# EAGLE design amplifier4c (EAGLE 6.5.0)
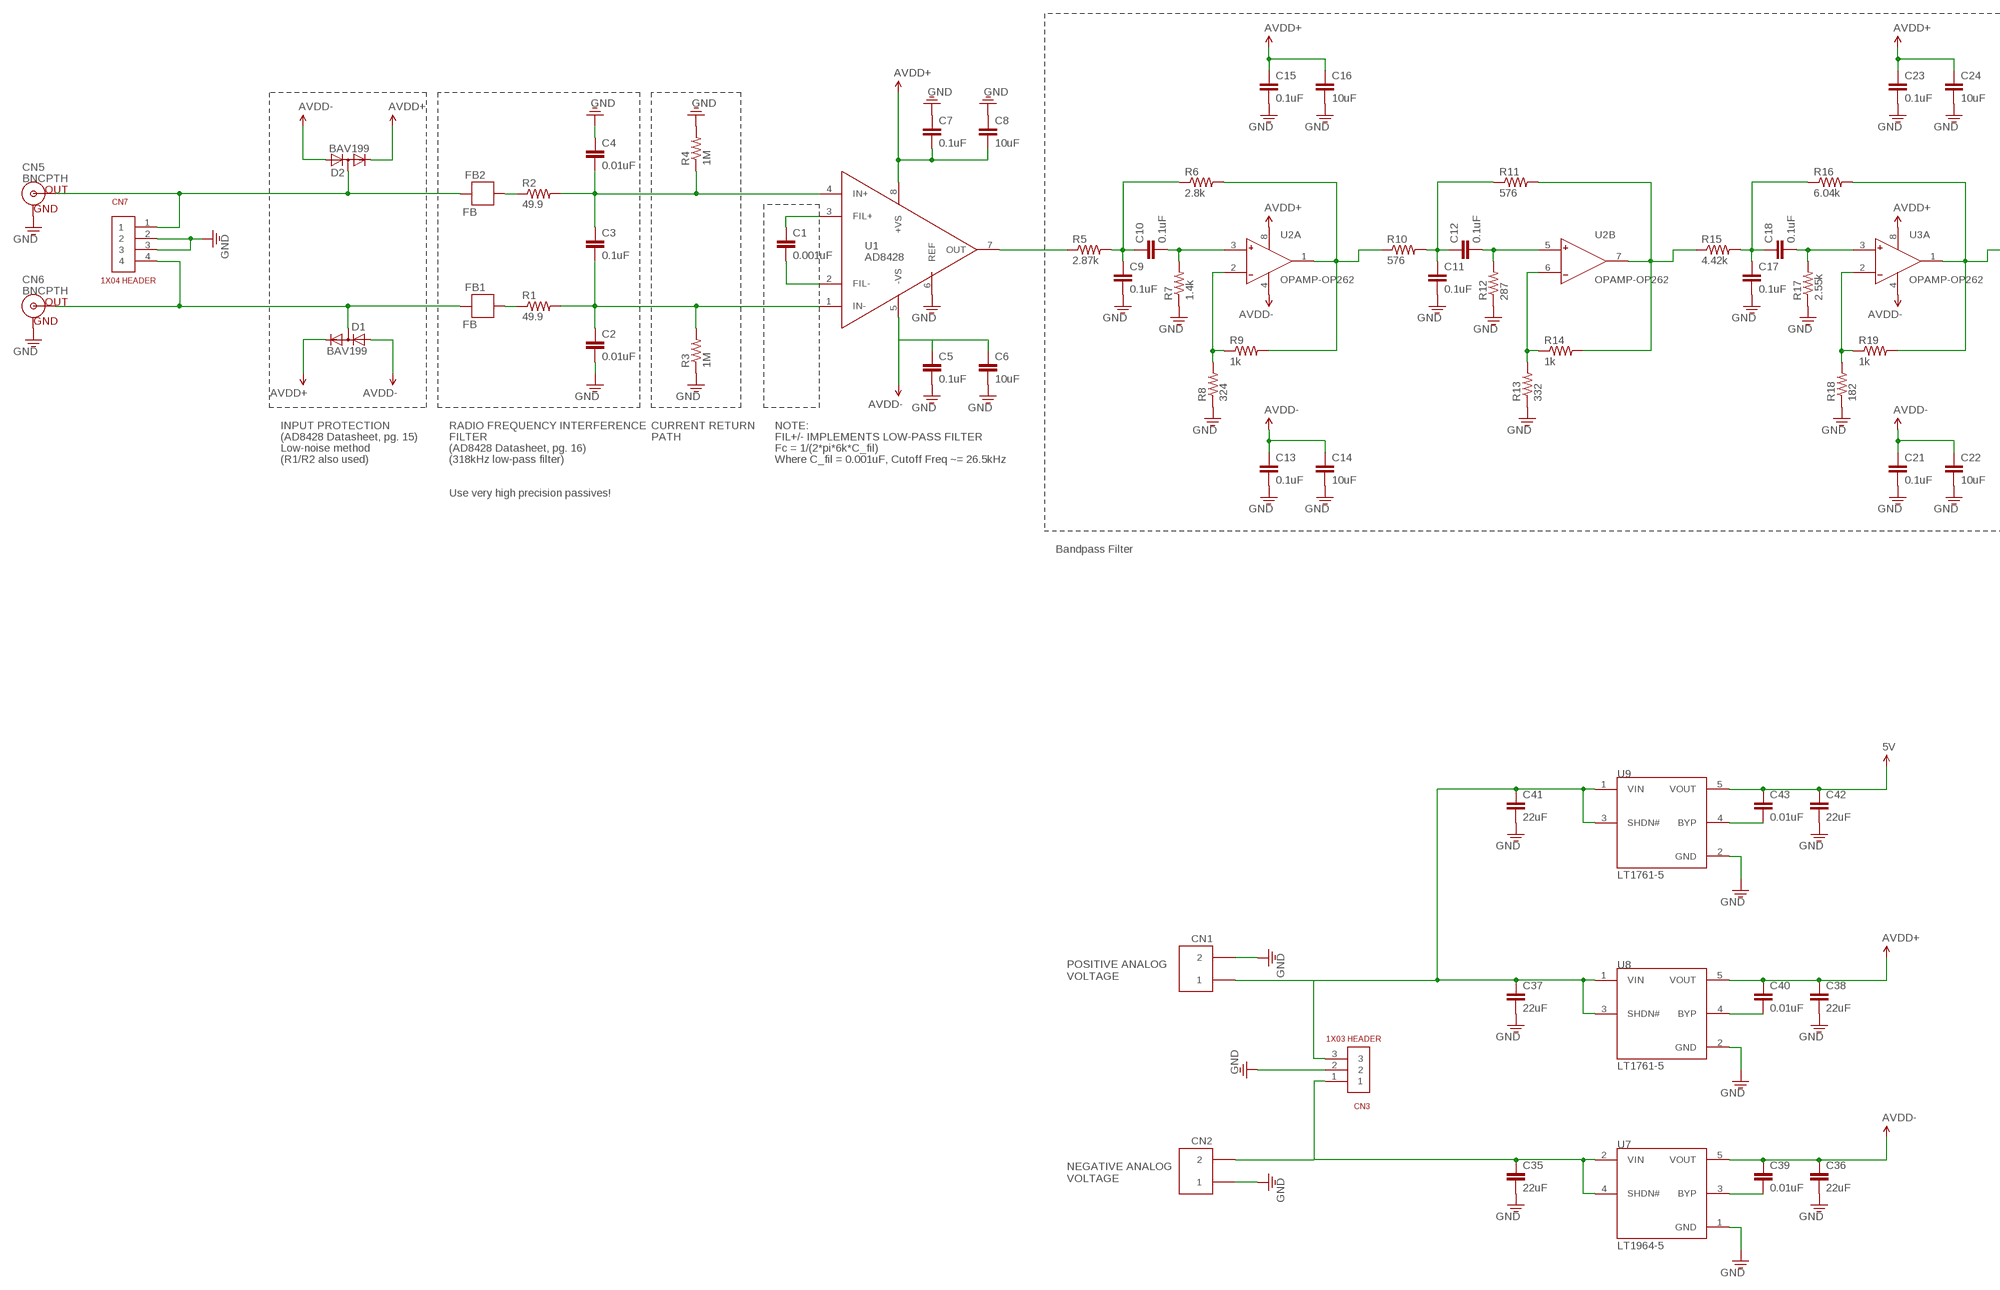
[diagram p0: schematic, sheet 1, part 1 of 2]
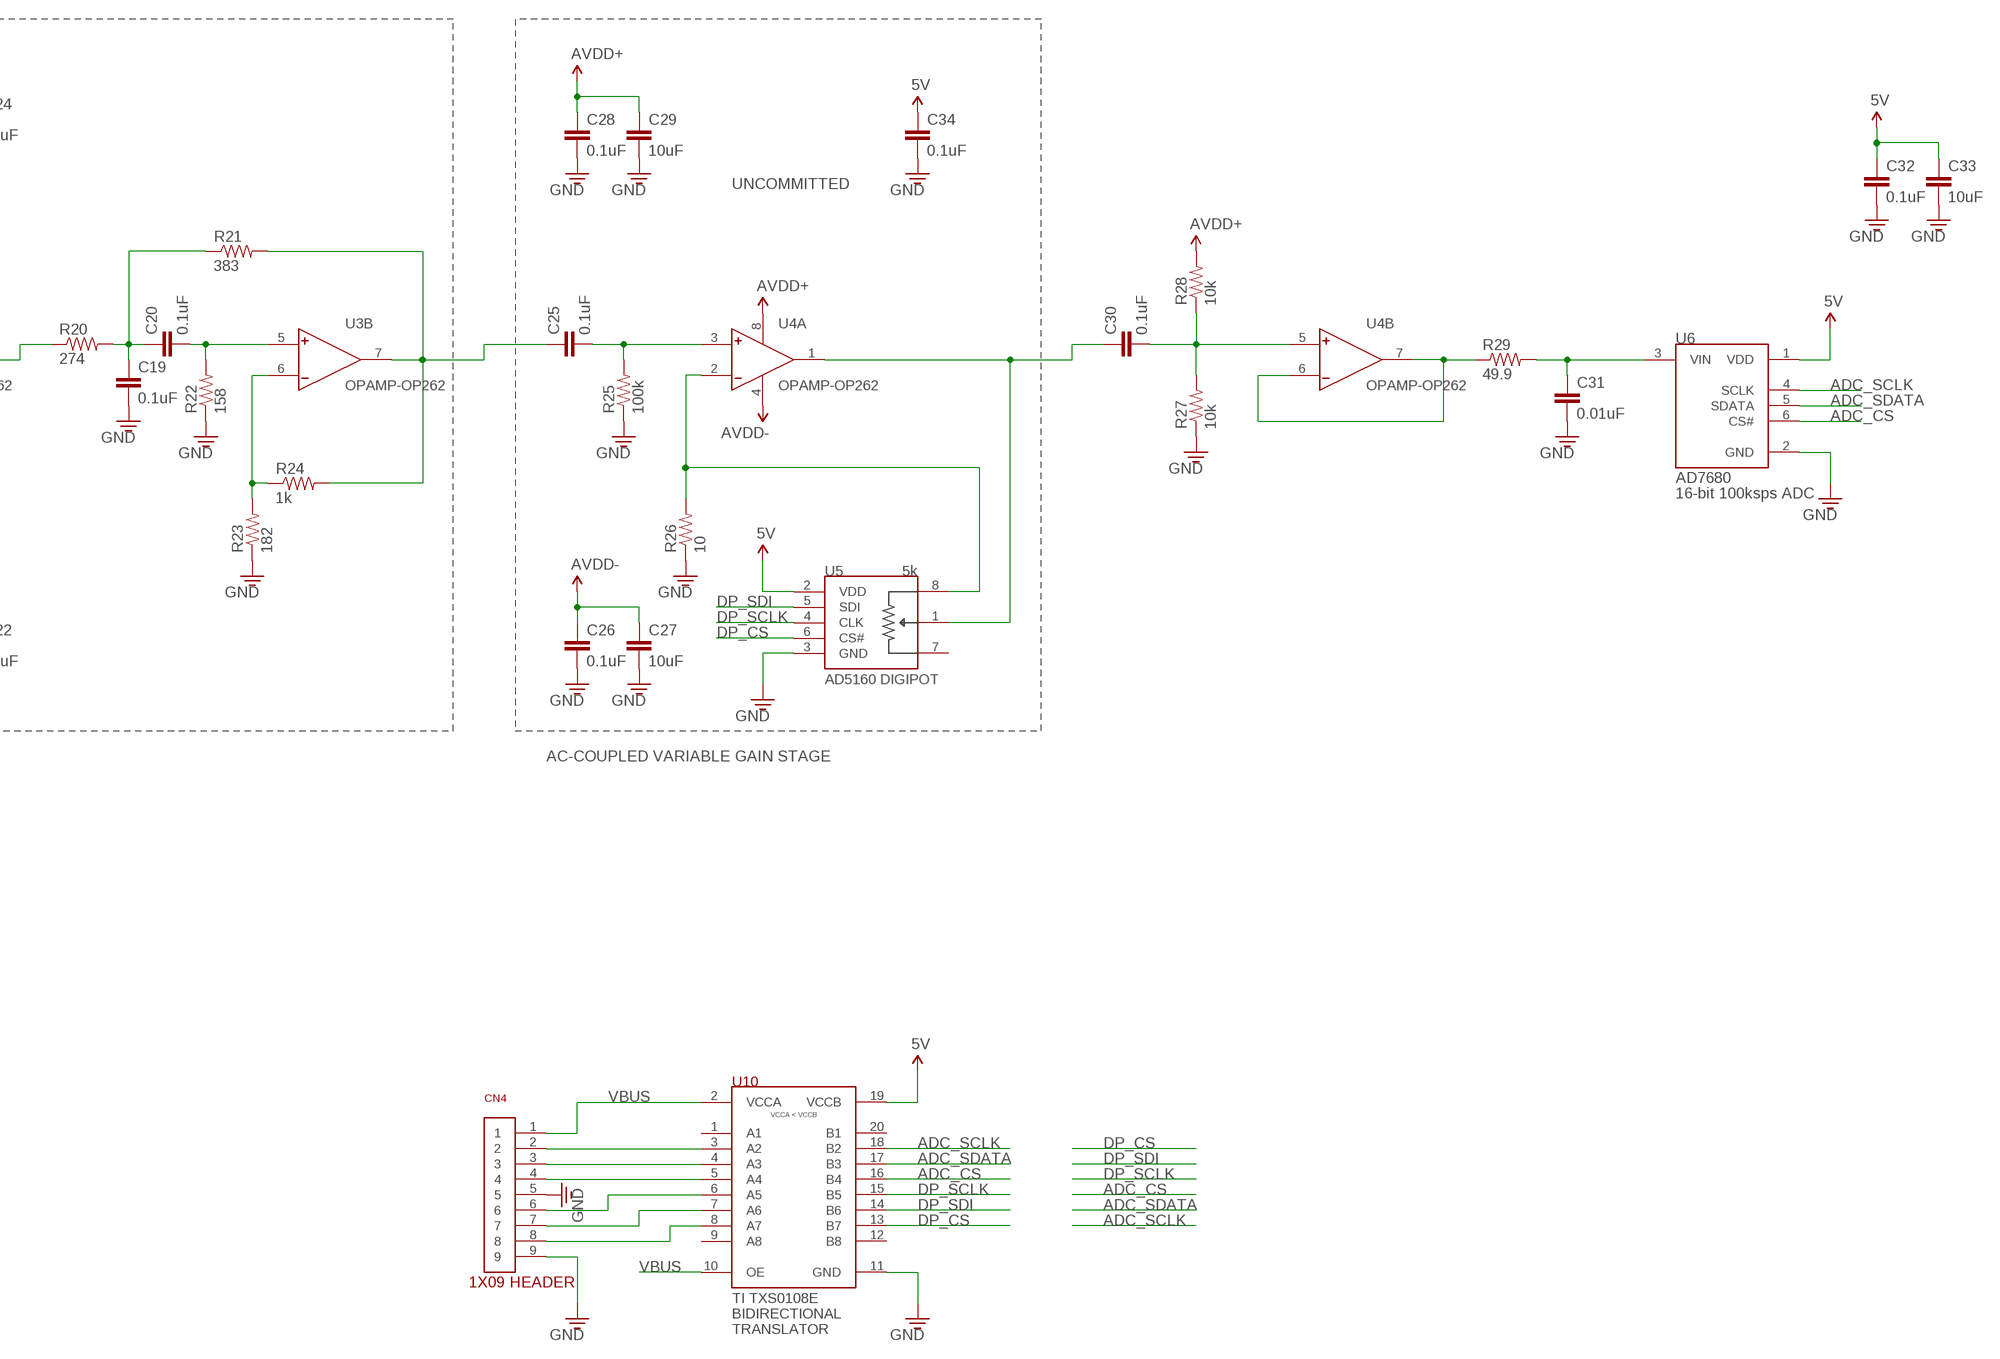
[diagram p1: schematic, sheet 1, part 2 of 2]

## Parts
C1  0.001uF  CAP0603  [0603]
C2  0.01uF  CAP0603  [0603]
C3  0.1uF  CAP0603  [0603]
C4  0.01uF  CAP0603  [0603]
C5  0.1uF  CAP0603  [0603]
C6  10uF  CAP0805  [0805]
C7  0.1uF  CAP0603  [0603]
C8  10uF  CAP0805  [0805]
C9  0.1uF  CAP0603  [0603]
C10  0.1uF  CAP0603  [0603]
C11  0.1uF  CAP0603  [0603]
C12  0.1uF  CAP0603  [0603]
C13  0.1uF  CAP0603  [0603]
C14  10uF  CAP0805  [0805]
C15  0.1uF  CAP0603  [0603]
C16  10uF  CAP0805  [0805]
C17  0.1uF  CAP0603  [0603]
C18  0.1uF  CAP0603  [0603]
C19  0.1uF  CAP0603  [0603]
C20  0.1uF  CAP0603  [0603]
C21  0.1uF  CAP0603  [0603]
C22  10uF  CAP0805  [0805]
C23  0.1uF  CAP0603  [0603]
C24  10uF  CAP0805  [0805]
C25  0.1uF  CAP0603  [0603]
C26  0.1uF  CAP0603  [0603]
C27  10uF  CAP0805  [0805]
C28  0.1uF  CAP0603  [0603]
C29  10uF  CAP0805  [0805]
C30  0.1uF  CAP0603  [0603]
C31  0.01uF  CAP0603  [0603]
C32  0.1uF  CAP0603  [0603]
C33  10uF  CAP0805  [0805]
C34  0.1uF  CAP0603  [0603]
C35  22uF  CAP1206  [1206]
C36  22uF  CAP1206  [1206]
C37  22uF  CAP1206  [1206]
C38  22uF  CAP1206  [1206]
C39  0.01uF  CAP0603  [0603]
C40  0.01uF  CAP0603  [0603]
C41  22uF  CAP1206  [1206]
C42  22uF  CAP1206  [1206]
C43  0.01uF  CAP0603  [0603]
CN1  SCREWTERMINAL-2PIN  [SCREWTERMINAL-2PIN]
CN2  SCREWTERMINAL-2PIN  [SCREWTERMINAL-2PIN]
CN3  1X03  [1X03]
CN4  1X09  [1X09]
CN5  BNCPTH  [BNC]
CN6  BNCPTH  [BNC]
CN7  1X04  [1X04]
D1  BAV199  [SOT23]
D2  BAV199  [SOT23]
FB1  FB  [0603]
FB2  FB  [0603]
R1  49.9  RESISTOR0603  [0603]
R2  49.9  RESISTOR0603  [0603]
R3  1M  RESISTOR0603  [0603]
R4  1M  RESISTOR0603  [0603]
R5  2.87k  RESISTOR0603  [0603]
R6  2.8k  RESISTOR0603  [0603]
R7  1.4k  RESISTOR0603  [0603]
R8  324  RESISTOR0603  [0603]
R9  1k  RESISTOR0603  [0603]
R10  576  RESISTOR0603  [0603]
R11  576  RESISTOR0603  [0603]
R12  287  RESISTOR0603  [0603]
R13  332  RESISTOR0603  [0603]
R14  1k  RESISTOR0603  [0603]
R15  4.42k  RESISTOR0603  [0603]
R16  6.04k  RESISTOR0603  [0603]
R17  2.55k  RESISTOR0603  [0603]
R18  182  RESISTOR0603  [0603]
R19  1k  RESISTOR0603  [0603]
R20  274  RESISTOR0603  [0603]
R21  383  RESISTOR0603  [0603]
R22  158  RESISTOR0603  [0603]
R23  182  RESISTOR0603  [0603]
R24  1k  RESISTOR0603  [0603]
R25  100k  RESISTOR0603  [0603]
R26  10  RESISTOR0603  [0603]
R27  10k  RESISTOR0603  [0603]
R28  10k  RESISTOR0603  [0603]
R29  49.9  RESISTOR0603  [0603]
U1  OPAMP-AD8428  [SOIC-8]
U2  OPAMP-OP262  [SOIC-8]
U3  OPAMP-OP262  [SOIC-8]
U4  OPAMP-OP262  [SOIC-8]
U5  5k  AD5160  [SOT-23-8]
U6  ADC-AD7680  [SOT-23-6L]
U7  LT1964-5  REG-LT1964-X  [SOT-23-5L]
U8  LT1761-5  REG-LT1761-X  [SOT-23-5L]
U9  LT1761-5  REG-LT1761-X  [SOT-23-5L]
U10  TRANSLATOR-TXS0108E  [TSSOP-20]

## Nets
5V: C32.1 C33.1 C34.1 C42.1 C43.1 U5.2(VDD) U6.1(VDD) U9.5(VOUT) U10.19(VCCB)
ADC_CS: U6.6(CS#) U10.16(B4)
ADC_SCLK: U6.4(SCLK) U10.18(B2)
ADC_SDATA: U6.5(SDATA) U10.17(B3)
AVDD+: C7.2 C8.2 C15.1 C16.1 C23.1 C24.1 C28.1 C29.1 C38.1 C40.1 D1.2(C) D2.2(C) R28.2 U1.8(+VS) U2.8(A:V+) U3.8(A:V+) U4.8(A:V+) U8.5(VOUT)
AVDD-: C5.1 C6.1 C13.1 C14.1 C21.1 C22.1 C26.1 C27.1 C36.1 C39.1 D1.1(A) D2.1(A) U1.5(-VS) U2.4(A:V-) U3.4(A:V-) U4.4(A:V-) U7.5(VOUT)
DP_CS: U5.6(CS#) U10.13(B7)
DP_SCLK: U5.4(CLK) U10.15(B5)
DP_SDI: U5.5(SDI) U10.14(B6)
GND: C2.2 C4.1 C5.2 C6.2 C7.1 C8.1 C9.2 C11.2 C13.2 C14.2 C15.2 C16.2 C17.2 C19.2 C21.2 C22.2 C23.2 C24.2 C26.2 C27.2 C28.2 C29.2 C31.2 C32.2 C33.2 C34.2 C35.2 C36.2 C37.2 C38.2 C41.2 C42.2 CN1.2 CN2.1 CN3.2 CN4.5 CN4.9 CN5.GND CN6.GND CN7.2 CN7.3 R3.1 R4.2 R7.1 R8.1 R12.1 R13.1 R17.1 R18.1 R22.1 R23.1 R25.1 R26.1 R27.1 U1.6(REF) U5.3(GND) U6.2(GND) U7.1(GND) U8.2(GND) U9.2(GND) U10.11(GND)
N$1: C1.1 U1.3(FIL+)
N$2: C1.2 U1.2(FIL-)
N$3: C3.1 C4.2 R2.2 R4.1 U1.4(IN+)
N$4: C2.1 C3.2 R1.2 R3.2 U1.1(IN-)
N$5: C9.1 C10.1 R5.2 R6.1
N$6: FB1.1 R1.1
N$7: FB2.1 R2.1
N$8: CN6.S(OUT) CN7.4 D1.3(AC) FB1.2
N$9: CN5.S(OUT) CN7.1 D2.3(AC) FB2.2
N$10: C10.2 R7.2 U2.3(A:+)
N$11: R8.2 R9.1 U2.2(A:-)
N$12: R5.1 U1.7(OUT)
N$13: R6.2 R9.2 R10.1 U2.1(A:OUT)
N$14: C25.2 R25.2 U4.3(A:+)
N$15: C11.1 C12.1 R10.2 R11.1
N$16: C12.2 R12.2 U2.5(B:+)
N$17: R13.2 R14.1 U2.6(B:-)
N$18: R11.2 R14.2 R15.1 U2.7(B:OUT)
N$19: C17.1 C18.1 R15.2 R16.1
N$20: C18.2 R17.2 U3.3(A:+)
N$21: R18.2 R19.1 U3.2(A:-)
N$22: R16.2 R19.2 R20.1 U3.1(A:OUT)
N$23: C19.1 C20.1 R20.2 R21.1
N$24: C20.2 R22.2 U3.5(B:+)
N$25: R23.2 R24.1 U3.6(B:-)
N$26: C25.1 R21.2 R24.2 U3.7(B:OUT)
N$27: R26.2 U4.2(A:-) U5.8(A)
N$28: C30.1 U4.1(A:OUT) U5.1(W)
N$29: C31.1 R29.2 U6.3(VIN)
N$30: C30.2 R27.2 R28.1 U4.5(B:+)
N$31: R29.1 U4.6(B:-) U4.7(B:OUT)
N$33: CN4.2 U10.3(A2)
N$34: CN4.3 U10.4(A3)
N$35: CN4.4 U10.5(A4)
N$36: CN4.6 U10.6(A5)
N$37: CN4.7 U10.7(A6)
N$38: CN4.8 U10.8(A7)
N$40: C40.2 U8.4(BYP)
N$42: C43.2 U9.4(BYP)
N$45: C39.2 U7.3(BYP)
VBUS: CN4.1 U10.2(VCCA) U10.10(OE)
VIN+: C37.1 C41.1 CN1.1 CN3.3 U8.1(VIN) U8.3(SHDN#) U9.1(VIN) U9.3(SHDN#)
VIN-: C35.1 CN2.2 CN3.1 U7.2(VIN) U7.4(SHDN#)
Unconnected: U5.7(B) U10.1(A1) U10.9(A8) U10.12(B8) U10.20(B1)

## Notes on the sheet
- UNCOMMITTED
- INPUT PROTECTION | RADIO FREQUENCY INTERFERENCE | CURRENT RETURN | NOTE:
- (AD8428 Datasheet, pg. 15) | FILTER | PATH | FIL+/- IMPLEMENTS LOW-PASS FILTER
- Low-noise method | (AD8428 Datasheet, pg. 16) | Fc = 1/(2*pi*6k*C_fil)
- (R1/R2 also used) | (318kHz low-pass filter) | Where C_fil = 0.001uF, Cutoff Freq ~= 26.5kHz
- Use very high precision passives!
- Bandpass Filter | AC-COUPLED VARIABLE GAIN STAGE
- POSITIVE ANALOG
  VOLTAGE
- NEGATIVE ANALOG
  VOLTAGE

## Library data of the parts
C1-C34 C39 C40 C43 = lowfieldmri:CAP: Capacitor Standard 0603 ceramic capacitor, and 0.1" leaded capacitor.
C35-C38 C41 C42 = SparkFun-Capacitors:CAP: Capacitor Standard 0603 ceramic capacitor, and 0.1" leaded capacitor.
CN1 CN2 = openct:SCREWTERMINAL-2PIN: 2-pin 5mm pitch screw terminal connector
CN3 = openct:1X03
CN4 = lowfieldmri:1X09
CN5 CN6 = SparkFun-Connectors:BNC: BNC Connector, Mouser Part# 5227161
CN7 = lowfieldmri:1X04
D1 D2 = diode:BAV199: DIODE low-leakage double diode
FB1 FB2 = SparkFun-Passives:FB
R1-R29 = lowfieldmri:RESISTOR: Resistor Basic schematic elements and footprints for 0603, 1206, and PTH 1/10th watt (small) resistors.
U1 = lowfieldmri:OPAMP-AD8428: Analog Devices AD8428 Low-noise Instrumentation Amplifier
U2-U4 = lowfieldmri:OPAMP-OP262: Analog Devices OP262 Low Noise Dual Op-amp
U5 = lowfieldmri:AD5160: AD5160 Digipot (256-Position, SPI-Compatible)
U6 = lowfieldmri:ADC-AD7680: Analog Devices AD7680 16-bit 100ksps ADC with SPI interface
U7 = lowfieldmri:REG-LT1964-X: Linear Technology 200ma low-noise negative regulator
U8 U9 = lowfieldmri:REG-LT1761-X: Linear Technology 200ma low-noise positive regulator; VALUE: LT1761-X
U10 = arducorder-mini:TRANSLATOR-TXS0108E: TI TXS0108 8-bit bidirectional autosensing level translator

## Board
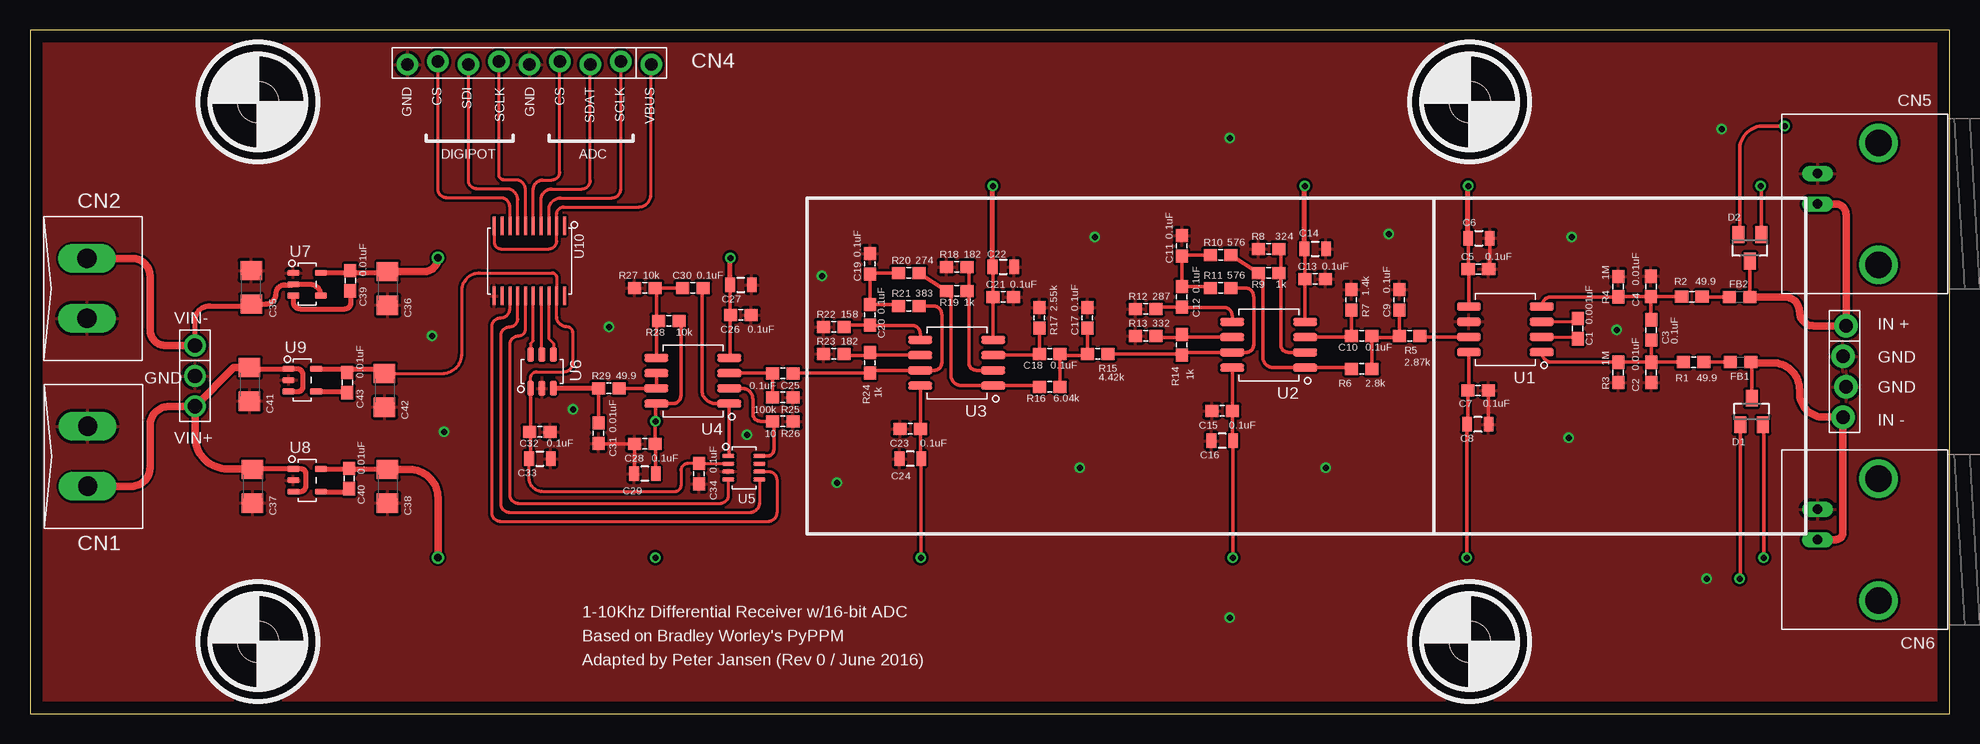
[diagram p2: board, top side]
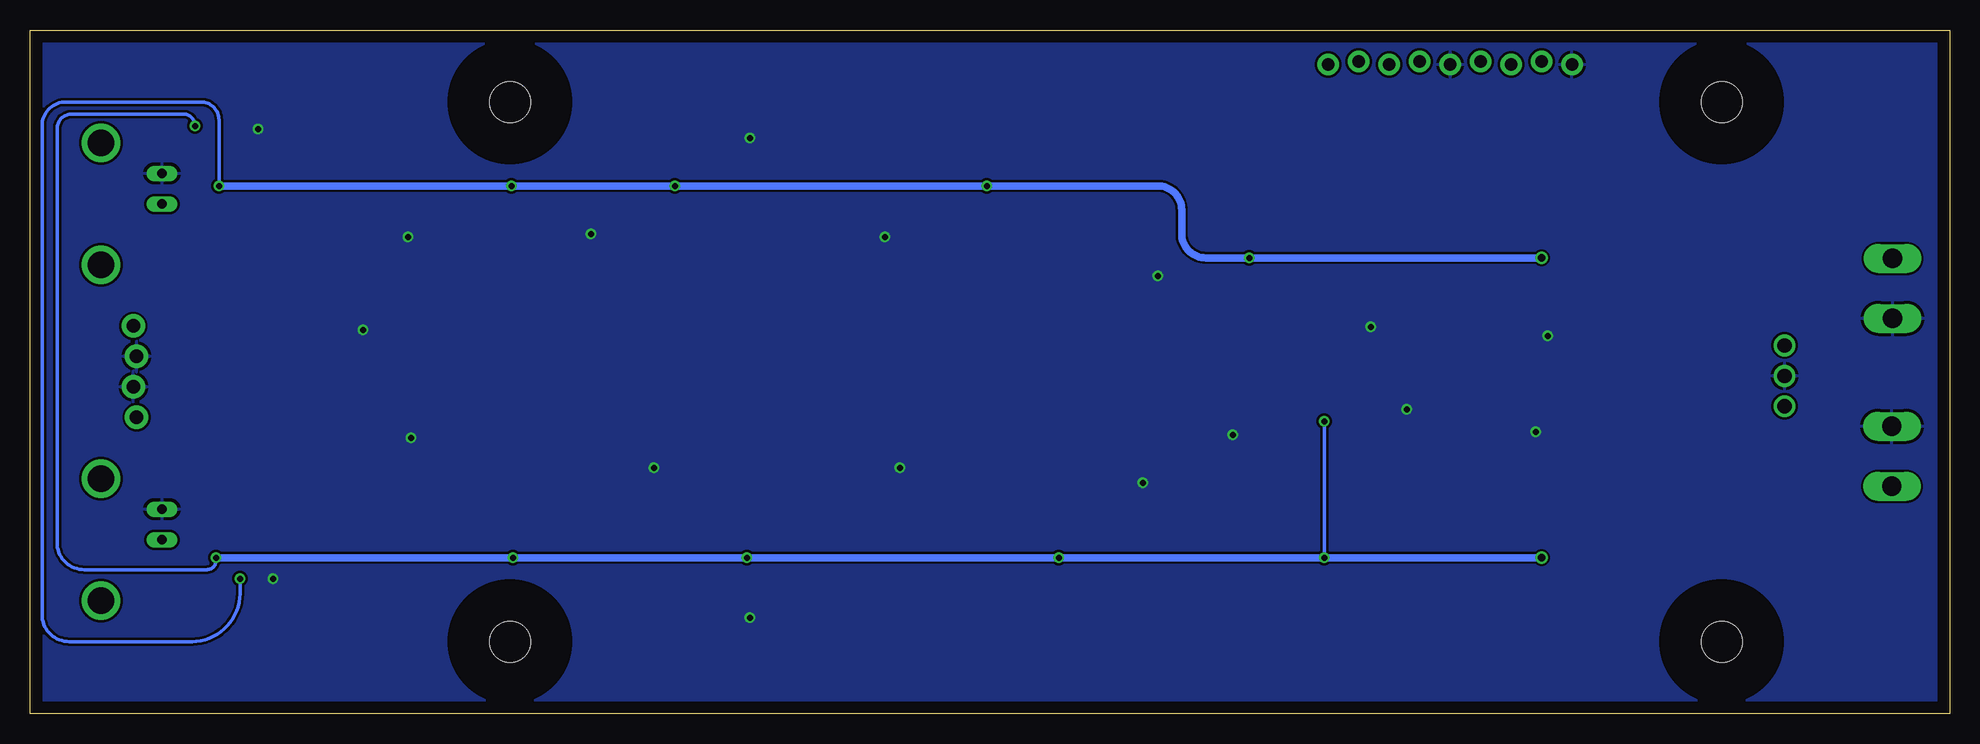
[diagram p3: board, bottom side, seen from below]

Size 160 x 57 mm. Coordinates in mm from the lower left corner, seen from the top.
Outline: 0,0 160,0 160,57 0,57 0,0
Copper layers (1*16): Top 0.035mm / dielectric 1.5mm / Bottom 0.035mm
Design rules "default": minimum track width 10mil, minimum drill 24mil, track to track 8mil, track to pad 8mil, pad to pad 8mil, via to via 8mil, smd to smd 8mil, copper to edge 40mil, drill to drill 8mil, minimum pad ring 10mil, minimum via ring 8mil, stop-mask expansion 4mil, vias tented up to drill 0mil, thermal gap 10mil
Holes 3.4 mm at 19,51 19,6 120,6 120,51
tRestrict: area 14,46 to 24,56; area 14,1 to 24,11; area 115,46 to 125,56; area 115,1 to 125,11
bRestrict: area 14,46 to 24,56; area 14,1 to 24,11; area 115,46 to 125,56; area 115,1 to 125,11

### Footprints (pad centres in the part's own frame; a part is rotated, then mirrored left to right if it is on the bottom)
0603 = smd 1.1 x 1: 1 -0.85,0; 2 0.85,0
0805 = smd 0.8 x 1.2: 1 -0.9,0; 2 0.9,0
1206 = smd 1.6 x 1.8: 1 -1.4,0; 2 1.4,0
SCREWTERMINAL-2PIN = drill 1.6 long: 1 -2.5,0; 2 2.5,0
1X03 = drill 1.2: 1 -2.54,0; 2 0,0; 3 2.54,0
1X09 = drill 1.016 pad 1.778: 1 -10.16,0.127; 2 -7.62,-0.127; 3 -5.08,0.127; 4 -2.54,-0.127; 5 0,0.127; 6 2.54,-0.127; 7 5.08,0.127; 8 7.62,-0.127; 9 10.16,0.127
BNC = drill 2.2: 3 -5.08,5.08; 4 5.08,5.08 | drill 0.8 long: GND -2.54,0; S 0,0
1X04 = drill 1.1 pad 1.93: 1 -5.08,0.127; 2 -2.54,-0.127; 3 0,0.127; 4 2.54,-0.127
SOT23 = smd 1 x 1.4: 1 -0.95,-1.1; 2 0.95,-1.1; 3 0,1.1
SOIC-8 = smd 0.7 x 2: 1 -1.905,-3.04; 2 -0.635,-3.04; 3 0.635,-3.04; 4 1.905,-3.04; 5 1.905,3.04; 6 0.635,3.04; 7 -0.635,3.04; 8 -1.905,3.04
SOT-23-8 = smd 0.35 x 1: 1 -0.975,-1.3; 2 -0.325,-1.3; 3 0.325,-1.3; 4 0.975,-1.3; 5 0.975,1.3; 6 0.325,1.3; 7 -0.325,1.3; 8 -0.975,1.3
SOT-23-6L = smd 0.55 x 1.2: 1 -0.95,-1.4; 2 0,-1.4; 3 0.95,-1.4; 4 0.95,1.4; 5 0,1.4; 6 -0.95,1.4
SOT-23-5L = smd 0.5 x 1: 1 -0.95,-1.15; 2 0,-1.15; 3 0.95,-1.15; 4 0.95,1.15; 5 -0.95,1.15
TSSOP-20 = smd 0.25 x 1.55: 1 -2.925,-2.925; 2 -2.275,-2.925; 3 -1.625,-2.925; 4 -0.975,-2.925; 5 -0.325,-2.925; 6 0.325,-2.925; 7 0.975,-2.925; 8 1.625,-2.925; 9 2.275,-2.925; 10 2.925,-2.925; 11 2.925,2.925; 12 2.275,2.925; 13 1.625,2.925; 14 0.975,2.925; 15 0.325,2.925; 16 -0.325,2.925; 17 -0.975,2.925; 18 -1.625,2.925; 19 -2.275,2.925; 20 -2.925,2.925

### Placement (x,y rotation side)
C1  129,32.1 270 top
C2  135.12,28.45 270 top
C3  135.13,31.99 270 top
C4  135.11,35.61 270 top
C5  120.73,37.06 0 top
C6  120.77,39.63 0 top
C7  120.7,26.94 180 top
C8  120.68,24.12 180 top
C9  114.12,34.5 90 top
C10  111,31.5 180 top
C11  96,39 90 top
C12  96,34.75 270 top
C13  107.12,36.25 0 top
C14  107.12,38.75 0 top
C15  99.38,25.25 180 top
C16  99.38,22.75 180 top
C17  88.12,33 90 top
C18  85,30 180 top
C19  70,37.5 90 top
C20  70,33.25 270 top
C21  81.12,34.75 0 top
C22  81.12,37.25 0 top
C23  73.38,23.75 180 top
C24  73.38,21.25 180 top
C25  62.75,28.38 180 top
C26  59.25,33.25 0 top
C27  59.25,35.75 0 top
C28  51.25,22.5 180 top
C29  51.25,20 180 top
C30  55.25,35.5 180 top
C31  47.38,23.38 270 top
C32  42.5,23.5 0 top
C33  42.5,21.25 0 top
C34  55.75,20 270 top
C35  18.45,35.55 90 top
C36  29.8,35.45 270 top
C37  18.55,18.95 270 top
C38  29.8,18.95 270 top
C39  26.7,36.1 270 top
C40  26.6,19.6 270 top
C41  18.3,27.45 270 top
C42  29.55,26.95 270 top
C43  26.45,27.6 270 top
CN1  4.8,21.45 90 top
CN2  4.75,35.45 90 top
CN3  13.75,28.15 270 top
CN4  41.62,54.25 180 top
CN5  149,42.5 270 top
CN6  149,14.5 270 top
CN7  151.25,27.25 270 top
D1  143.5,25.19 0 top
D2  143.35,38.83 180 top
FB1  142.59,29.3 0 top
FB2  142.5,34.74 0 top
R1  138.66,29.3 180 top
R2  138.52,34.76 180 top
R3  132.38,28.45 90 top
R4  132.38,35.59 90 top
R5  115,31.5 180 top
R6  111,28.75 180 top
R7  110.12,34.5 270 top
R8  103.25,38.75 0 top
R9  103.25,36.75 180 top
R10  99.25,38.25 180 top
R11  99.25,35.5 0 top
R12  93,33.75 0 top
R13  93,31.5 0 top
R14  96,30.75 270 top
R15  89,30 180 top
R16  85,27.25 180 top
R17  84.12,33 270 top
R18  77.25,37.25 0 top
R19  77.25,35.25 180 top
R20  73.25,36.75 180 top
R21  73.25,34 0 top
R22  67,32.25 0 top
R23  67,30 0 top
R24  70,29.25 270 top
R25  62.75,26.38 180 top
R26  62.75,24.38 180 top
R27  51.25,35.5 0 top
R28  53.25,32.75 0 top
R29  48.25,27.12 180 top
U1  122.97,32.04 90 top
U2  103.25,30.75 90 top
U3  77.25,29.25 90 top
U4  55.25,27.75 90 top
U5  59.5,20.5 270 top
U6  42.67,28.52 0 top
U7  23.1,35.8 270 top
U8  23.1,19.45 270 top
U9  22.7,27.8 270 top
U10  41.62,37.75 180 top

### Tracks (layer width: path | path; a pad name or v marks a point on that pad's centre or on a via)
5V
  Top 0.254: U5.2 55.77,20.83 C34.1 54.85,20.85 arc90 54.25,20.25 54.25,19 arc-90 53.75,18.5 42.75,18.5 arc-90 41.6,19.65 C33.1 | U6.1 41.73,27.98 arc-90 42.25,28.5 44.5,28.5 arc90 45.25,29.25 45.25,31.75 arc90 44.75,32.25 arc-90 43.9,33.1 U10.19 43.9,36.35 arc90 43.5,36.75 37.5,36.75 arc90 36,35.25 36,30 arc-90 34.35,28.35 C42.1
  Top 0.305: U6.1 41.73,23.5 | 41.73,23.5 41.73,21.38 C33.1 | C32.1 41.73,23.5
  Top 0.406: U9.5 26.5,28.75 | 26.5,28.75 29.15,28.75 arc-90 C42.1 | C43.1 26.45,28.7 arc-90 26.5,28.75
ADC_CS
  Top 0.254: U6.6 41.73,30.85 41.95,31.08 U10.16
ADC_SCLK
  Top 0.254: U6.4 43.62,30.88 43.25,31.25 U10.18
ADC_SDATA
  Top 0.254: U10.17 42.6,30 U6.5
AVDD+  (via drill 0.5, 0.6)
  Top 0.305: U1.8 119.93,27.02 C7.2 119.85,24.19 C8.2 119.78,13.03 v119.75,13 | U2.8 C15.1 | C15.1 100.21,22.81 C16.1 100.28,13.02 v100.25,13 | C15.1 | U3.8 C23.1 | C23.1 74.21,21.31 C24.1 74.28,13.02 v74.25,13 | C23.1 | C29.1 52.15,22.5 C28.1 52.1,24.38 v52.12,24.38 52.12,25.82 52.15,25.84 U4.8 53.59,25.84 arc90 54.25,26.5 54.25,32.6 arc90 R28.2 | 144.5,24.09 D1.2 144.5,24.04 v144.5,13 | v146.25,49 144.5,49 arc90 142.5,47 142.5,40.02 arc-90 D2.2
  Top 0.406: U8.5 26.75,20.4 | 26.75,20.4 29.8,20.4 C38.1 | C40.1 26.75,20.45 26.75,20.4
  Top 0.61: C38.1 31.65,20.35 arc-90 34,18 v34,13
  Bottom 0.305: v52.12,24.38 v52.12,13 | v144.5,13 144.5,12.75 arc90 145.25,12 155.5,12 arc90 157.75,14.25 157.75,48.75 arc90 156.5,50 147.25,50 arc90 v146.25,49
  Bottom 0.61: v34,13 v52.12,13 v74.25,13 v100.25,13 v119.75,13 v144.5,13
AVDD-  (via drill 0.5, 0.6)
  Top 0.305: C5.1 | U1.5 119.93,37.01 C5.1 | U2.4 106.29,36.23 C13.1 106.28,38.7 C14.1 | U3.4 80.29,34.73 C21.1 80.28,37.2 C22.1 | C27.1 58.35,33.25 | 58.35,33.25 58.35,29.66 U4.4 | C26.1 58.35,33.25 | C6.1 C5.1 | D2.1 144.31,43.95 v144.25,44 | D1.1 142.56,11.3 v142.5,11.25
  Top 0.406: C36.1 29.7,36.75 26.75,36.75 | 26.75,36.75 U7.5 | C39.1 26.75,36.9 26.75,36.75 | C27.1 58.35,37.98 v58.38,38 | C22.1 80.22,43.98 v80.25,44 | C14.1 106.22,43.98 v106.25,44 | C6.1 v119.87,43.99 v119.88,44
  Top 0.61: C36.1 32.85,36.85 arc90 v34,38
  Bottom 0.305: v142.5,11.25 142.5,10 arc90 146.5,6 156.75,6 arc90 159,8.25 159,49 arc90 157,51 145.75,51 arc90 144.25,49.5 v144.25,44
  Bottom 0.61: v34,38 v58.38,38 62,38 arc90 64,40 64,42 arc-90 66,44 v80.25,44 v106.25,44 v119.88,44 v144.25,44
DP_CS
  Top 0.254: U5.6 61.58,20.17 arc-90 62.25,19.5 62.25,16.75 arc-90 61.5,16 39.25,16 arc-90 38.5,16.75 38.5,32.25 arc-90 39.25,33 arc90 40,33.75 U10.13
DP_SCLK
  Top 0.254: U5.4 58.2,18.2 arc-90 57.5,17.5 40.75,17.5 arc-90 40,18.25 40,30.75 arc-90 40.75,31.5 arc90 41.3,32.05 U10.15
DP_SDI
  Top 0.254: U5.5 60.8,17.55 arc-90 60,16.75 40,16.75 arc-90 39.25,17.5 39.25,31.5 arc-90 40,32.25 arc90 40.65,32.9 U10.14
GND  (via drill 0.5)
  Top 0.305: C8.1 121.58,26.91 C7.1 | C6.2 121.67,37.15 C5.2 | C31.2 47.38,22.5 C28.2 50.4,20 C29.2
  other vias: 59.75,23.25 45.25,25.38 34.5,23.5 33.5,31.5 66,36.5 67.25,19.25 87.5,20.5 88.75,39.75 113.25,40 108,20.5 128.5,39.75 128.25,23 132.25,32 139.75,11.25 141,48.75 100,48 100,8 48.25,32.25
  pour Top: 0,56 0,1 160,1 160,56
  pour Bottom: 0,56 0,1 160,1 160,56
N$1
  Top 0.254: U1.3 128.72,32.67 C1.1
N$2
  Top 0.254: U1.2 128.84,31.41 C1.2
N$3
  Top 0.254: C4.2 | 132.4,34.76 R4.1 | 135.12,32.86 C3.1
  Top 0.305: R2.2 C4.2 135.12,32.86 | C4.2 132.4,34.76 | R4.1 126.81,34.74 arc90 U1.4
N$4
  Top 0.254: C2.1 135.13,29.31
  Top 0.305: R1.2 C2.1 | C2.1 R3.2 126.84,29.3 arc-90 U1.1 | C3.2 135.13,29.31
N$5
  Top 0.305: R6.1 C10.1 111.97,31.38 114.03,31.38 R5.2 114.12,31.52 C9.1
N$6
  Top 0.254: 139.53,29.3 R1.1
  Top 0.305: FB1.1 139.53,29.3
N$7
  Top 0.254: 139.38,34.74 R2.1
  Top 0.305: FB2.1 139.38,34.74
N$8
  Top 0.254: 143.44,29.28 FB1.2
  Top 0.305: 143.44,29.28 143.5,29.28 D1.3
  Top 0.61: CN6.S 150.5,14.5 arc90 151.12,15.12 CN7.4 149.54,24.71 arc-90 147.5,26.75 147.5,27 arc90 145.25,29.25 143.48,29.25 arc-90 FB1.2
N$9
  Top 0.254: 143.37,34.73 FB2.2
  Top 0.305: 143.37,34.73 FB2.2 D2.3
  Top 0.61: CN5.S 150.5,42.5 arc-90 151.38,41.62 CN7.1 148.67,32.33 arc-90 147.5,33.5 arc90 146.25,34.74 FB2.2
N$10
  Top 0.305: U2.3 110.03,31.38 C10.2 110.12,31.52 R7.2
N$11
  Top 0.305: U2.2 arc90 U2.2 104.88,30.12 arc-90 104.25,30.75 104.25,36.75 | 104.25,36.75 104.25,38.75 R8.2 | R9.1 104.25,36.75
N$12
  Top 0.305: U1.7 115.94,31.41 R5.1
N$13
  Top 0.305: R6.2 110.06,28.84 U2.1 103.66,28.84 arc-90 102.75,29.75 102.75,36.65 arc90 R9.2 R10.1
N$14
  Top 0.305: U4.3 C25.2 R25.2
N$15
  Top 0.305: R10.2 96.1,38.25 C11.1 C12.1 98.3,35.6 R11.1
N$16
  Top 0.305: R12.2 94,33.9 C12.2 arc90 96.03,33.88 99.5,33.88 arc-90 100.21,33.16 U2.5
N$17
  Top 0.305: U2.6 96.22,31.38 R14.1 95.78,31.38 94,31.38 93.88,31.5 R13.2
N$18
  Top 0.305: R11.2 101.25,35.5 arc-90 102,34.75 102,30.75 arc-90 101.36,30.12 U2.7 96.03,30.12 R14.2 96,30 R15.1
N$19
  Top 0.305: R16.1 C18.1 85.97,29.88 88.03,29.88 R15.2 88.12,30.02 C17.1
N$20
  Top 0.305: U3.3 84.03,29.88 C18.2 84.12,30.02 R17.2
N$21
  Top 0.305: U3.2 arc90 U3.2 78.88,28.62 arc-90 78.25,29.25 78.25,35.25 | 78.25,35.25 78.25,37.25 R18.2 | R19.1 78.25,35.25
N$22
  Top 0.305: R16.2 84.06,27.34 U3.1 77.66,27.34 arc-90 76.75,28.25 76.75,35.15 arc90 R19.2 R20.1
N$23
  Top 0.305: R20.2 70.1,36.75 C19.1 C20.1 72.3,34.1 R21.1
N$24
  Top 0.305: R22.2 68,32.4 C20.2 arc90 70.03,32.38 73.5,32.38 arc-90 74.21,31.66 U3.5
N$25
  Top 0.305: U3.6 70.22,29.88 R24.1 69.78,29.88 68,29.88 67.88,30 R23.2
N$26
  Top 0.305: R21.2 75.25,34 arc-90 76,33.25 76,29.25 arc-90 75.36,28.62 U3.7 70.03,28.62 R24.2 63.6,28.4 C25.1
N$27
  Top 0.305: U4.2 arc-90 U4.2 59.38,27.12 arc-90 60.25,26.25 60.25,25 arc90 60.88,24.38 R26.2 arc-90 62,24.27 62,22 arc-90 61.48,21.48 U5.8
N$28
  Top 0.305: U5.1 arc90 58.25,21.52 58.25,25.8 arc-90 U4.1 57.16,25.84 arc-90 56,27 56,35.35 arc90 C30.1
N$29
  Top 0.305: R29.2 47.4,24.23 C31.1
  Top 0.406: R29.2 U6.3
N$30
  Top 0.305: 51.75,29.66 U4.5 52.21,32.75 | C30.2 R27.2 52.21,35.5 52.21,32.75 | R28.1 52.21,32.75
N$31
  Top 0.305: U4.6 U4.7 R29.1
N$33
  Top 0.254: U10.3 43.25,42 arc-90 44.25,43 48.5,43 arc90 49.25,43.75 CN4.2 arc90 CN4.2
N$34
  Top 0.254: U10.4 42.6,42.85 arc-90 43.5,43.75 46,43.75 arc90 46.7,44.45 CN4.3
N$35
  Top 0.254: U10.5 41.95,43.7 arc-90 42.75,44.5 43.5,44.5 arc90 44.16,45.16 CN4.4
N$36
  Top 0.254: U10.6 41.3,43.7 arc90 40.5,44.5 39.5,44.5 arc-90 39.09,44.91 CN4.6
N$37
  Top 0.254: U10.7 40.65,42.85 arc90 39.75,43.75 37.25,43.75 arc-90 36.55,44.45 CN4.7
N$38
  Top 0.254: U10.8 40,42.25 arc90 39.25,43 34.75,43 arc-90 34,43.75 CN4.8 arc-90 CN4.8
N$40
  Top 0.406: U8.4 26.6,18.5 C40.2
N$42
  Top 0.406: U9.4 26.35,26.85 arc-90 C43.2
N$45
  Top 0.406: U7.3 21.95,34.3 arc90 22.5,33.75 26.25,33.75 arc90 26.75,34.25 26.75,35.2 arc90 C39.2
VBUS
  Top 0.254: U10.10 38.7,39.3 arc90 39.25,38.75 43.25,38.75 arc90 43.9,39.4 U10.2 43.9,41.65 arc-90 44.5,42.25 50.75,42.25 arc90 51.75,43.25 51.75,54.09 arc-90 CN4.1
VIN+
  Top 0.406: C41.1 18.4,28.75 U9.1 22.25,28.75 arc-90 22.75,28.25 22.75,27.25 arc-90 22.35,26.85 U9.3 | 18.6,20.4 C37.1 arc-90 18.6,20.4 | U8.3 22.5,18.5 arc90 23,19 23,20 arc90 22.6,20.4 U8.1 18.6,20.4
  Top 0.61: CN3.3 16.99,28.85 C41.1 | 18.6,20.4 16.48,20.4 arc-90 13.75,23.12 CN3.3 | CN1.1 8.45,18.95 arc90 10,20.5 10,24 arc-90 11.61,25.61 CN3.3
VIN-
  Top 0.406: CN3.1 13.75,32.75 arc-90 15,34 18.3,34 arc90 C35.1 19.65,34.15 arc90 20.5,35 arc-90 21.25,35.75 21.9,35.75 arc90 U7.2 23.3,35.8 arc-90 U7.4
  Top 0.61: CN2.2 8.55,37.95 arc-90 10,36.5 10,32 arc90 11.31,30.69 CN3.1

### Text on the board
tPlace: GND | CS | SDI | SCLK | GND | CS | SDAT | SCLK | VBUS | DIGIPOT | ADC | VIN- | IN + | GND | GND | GND | IN - | VIN+ | 1-10Khz Differential Receiver w/16-bit ADC | Based on Bradley Worley's PyPPM | Adapted by Peter Jansen (Rev 0 / June 2016)